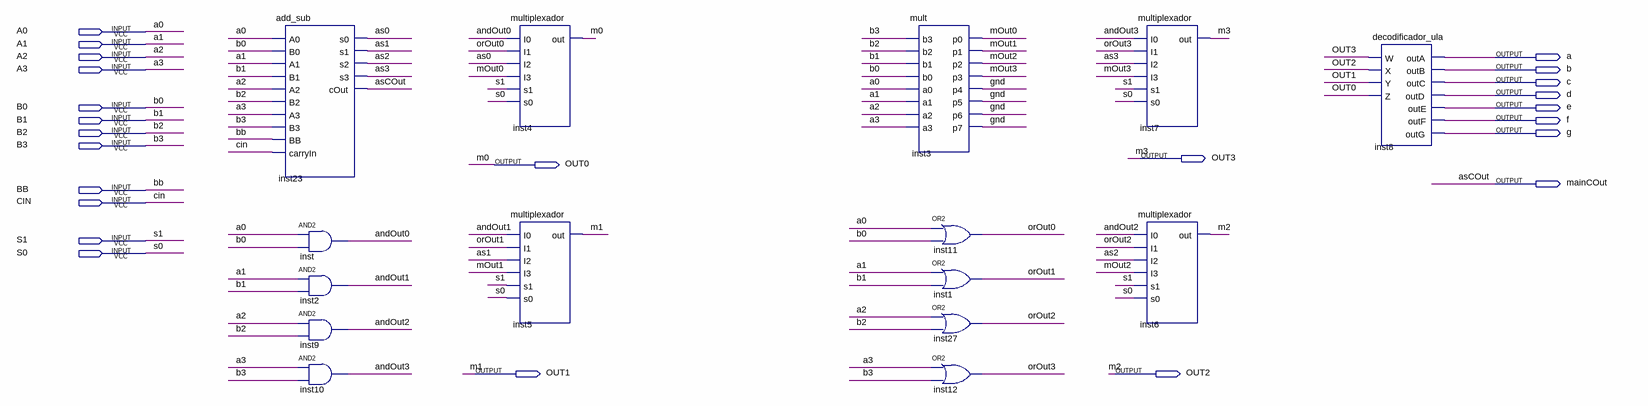
[diagram p0: schematic sheet]
// Quartus schematic ula.bdf as structural Verilog: 15 symbols, 24 pins
module ula (
  input  A0,
  input  A1,
  input  A2,
  input  A3,
  input  B0,
  input  B1,
  input  B2,
  input  B3,
  input  BB,
  input  CIN,
  input  S1,
  input  S0,
  output a,
  output b,
  output c,
  output d,
  output e,
  output f,
  output g,
  output OUT3,
  output OUT0,
  output mainCOut,
  output OUT1,
  output OUT2
);

  wire andOut0, andOut1, andOut2, andOut3, as0, as1, as2, as3, gnd, mOut0, mOut1, mOut2, mOut3, orOut0,
       orOut1, orOut2, orOut3;

  add_sub inst23 (
    .A0(A0), .B0(B0), .A1(A1), .B1(B1), .A2(A2), .B2(B2), .A3(A3), .B3(B3), .BB(BB), .carryIn(CIN), .s0(as0),
    .s1(as1), .s2(as2), .s3(as3), .cOut(mainCOut));
  and inst (andOut0, A0, B0);
  and inst2 (andOut1, A1, B1);
  and inst9 (andOut2, A2, B2);
  and inst10 (andOut3, A3, B3);
  multiplexador inst4 (.I0(andOut0), .I1(orOut0), .I2(as0), .I3(mOut0), .s1(S1), .s0(S0), .out(OUT0));
  multiplexador inst5 (.I0(andOut1), .I1(orOut1), .I2(as1), .I3(mOut1), .s1(S1), .s0(S0), .out(OUT1));
  mult inst3 (
    .b3(B3), .b2(B2), .b1(B1), .b0(B0), .a0(A0), .a1(A1), .a2(A2), .a3(A3), .p0(mOut0), .p1(mOut1),
    .p2(mOut2), .p3(mOut3), .p4(gnd), .p5(gnd), .p6(gnd), .p7(gnd));
  or inst11 (orOut0, A0, B0);
  or inst1 (orOut1, A1, B1);
  or inst27 (orOut2, A2, B2);
  or inst12 (orOut3, A3, B3);
  multiplexador inst7 (.I0(andOut3), .I1(orOut3), .I2(as3), .I3(mOut3), .s1(S1), .s0(S0), .out(OUT3));
  multiplexador inst6 (.I0(andOut2), .I1(orOut2), .I2(as2), .I3(mOut2), .s1(S1), .s0(S0), .out(OUT2));
  decodificador_ula inst8 (
    .W(OUT3), .X(OUT2), .Y(OUT1), .Z(OUT0), .outA(a), .outB(b), .outC(c), .outD(d), .outE(e), .outF(f),
    .outG(g));

  // Other names for the same wires on the sheet: asCOut = mainCOut; m0 = OUT0; m1 = OUT1; m2 = OUT2; m3 = OUT3
endmodule
